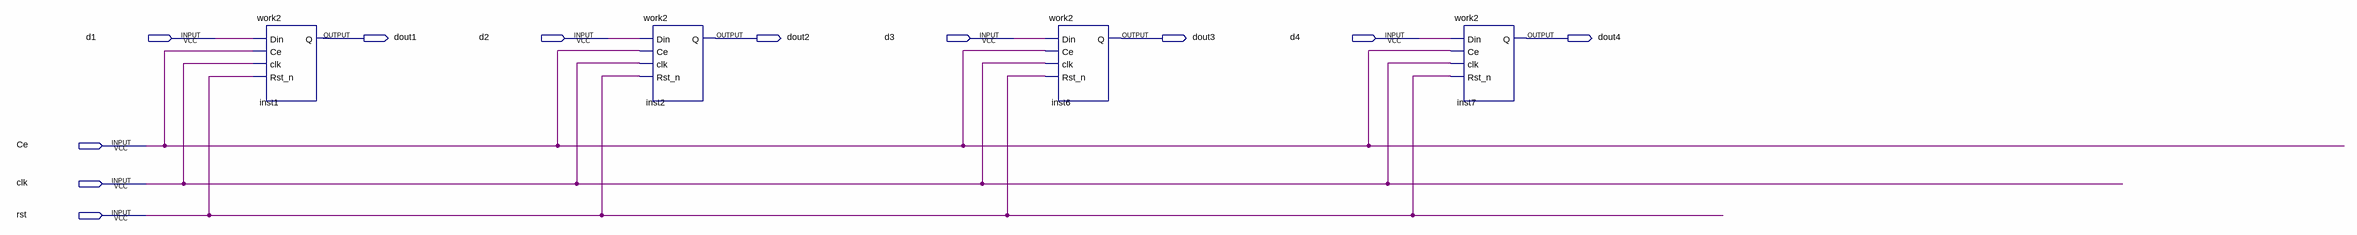
[diagram p0: schematic sheet]
// Quartus schematic fourregister.bdf as structural Verilog: 4 symbols, 11 pins
module fourregister (
  input  d1,
  input  d2,
  input  d3,
  input  d4,
  input  Ce,
  input  clk,
  input  rst,
  output dout1,
  output dout2,
  output dout3,
  output dout4
);

  work2 inst1 (.Din(d1), .Ce(Ce), .clk(clk), .Rst_n(rst), .Q(dout1));
  work2 inst2 (.Din(d2), .Ce(Ce), .clk(clk), .Rst_n(rst), .Q(dout2));
  work2 inst6 (.Din(d3), .Ce(Ce), .clk(clk), .Rst_n(rst), .Q(dout3));
  work2 inst7 (.Din(d4), .Ce(Ce), .clk(clk), .Rst_n(rst), .Q(dout4));
endmodule
